# Altium schematic sheet UC3844 - SIMU COMPACTA.SCHDOC
size A
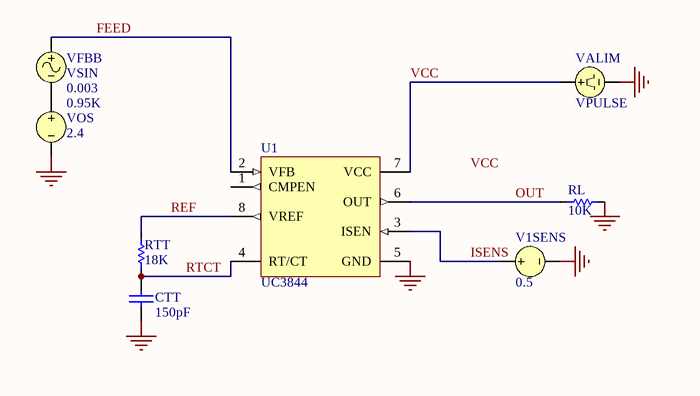
[diagram p0: UC3844 - SIMU COMPACTA.SCHDOC]

## Parts
CTT  value 150pF  [0805]  (hidden comment: Cap)
RL  value 10K  [0805]  (hidden comment: Res)
RTT  value 18K  [0805]  (hidden comment: Res)
U1  UC3844  [DIP8Z]
V1SENS  value 0.5  (hidden comment: VSRC)
VALIM  VPULSE
VFBB  VSIN  Amplitude: 0.003  Frequency: 0.95K
VOS  value 2.4  (hidden comment: VSRC)

## Nets
GND: CTT.1 RL.1 U1.5(GND) V1SENS.2 VALIM.2 VOS.2
FEED: U1.2(VFB) VFBB.1
ISENS: U1.3(ISEN) V1SENS.1
OUT: RL.2 U1.6(OUT)
REF: RTT.2 U1.8(VREF)
RTCT: CTT.2 RTT.1 U1.4(RT/CT)
VCC: U1.7(VCC) VALIM.1
NetVFBB_2: VFBB.2 VOS.1

Not connected (* = marked no-connect by the designer): U1 1(CMPEN)

## Notes on the sheet
- Labels drawn without touching a wire or pin: VCC

## Library data of the parts
CTT = Cap: Capacitor; Voltage: 50V; Price: 0.25; Technology: Ceramic
RL RTT = Res: Resistor; Power: 0.25W; Price: 0.036
U1 = UC3844: Current-Mode PWM Controller
V1SENS VOS = VSRC: Voltage Source; Note: PCB Footprint - Not required; Published: 8-Jun-2000; Revision: 17-Jul-2002: Re-released for DXP Platform.; Package Reference: Not Applicable; Publisher: Altium Limited
VALIM = VPULSE: Pulse Voltage Source; Note: PCB Footprint - Not required; Published: 8-Jun-2000; Revision: 17-Jul-2002: Re-released for DXP Platform.; Package Reference: Not Applicable; Publisher: Altium Limited
VFBB = VSIN: Sinusoidal Voltage Source; Revision 1: 15-Jun-2001: Default value added for damping factor (F8:0).; Revision 2: 17-July-2002: Re-released for DXP Platform.; Note: PCB Footprint - Not required; Published: 8-Jun-2000; Package Reference: Not Applicable; Publisher: Altium Limited